# Altium schematic sheet 2020年电赛校赛控制板.SchDoc
size A4
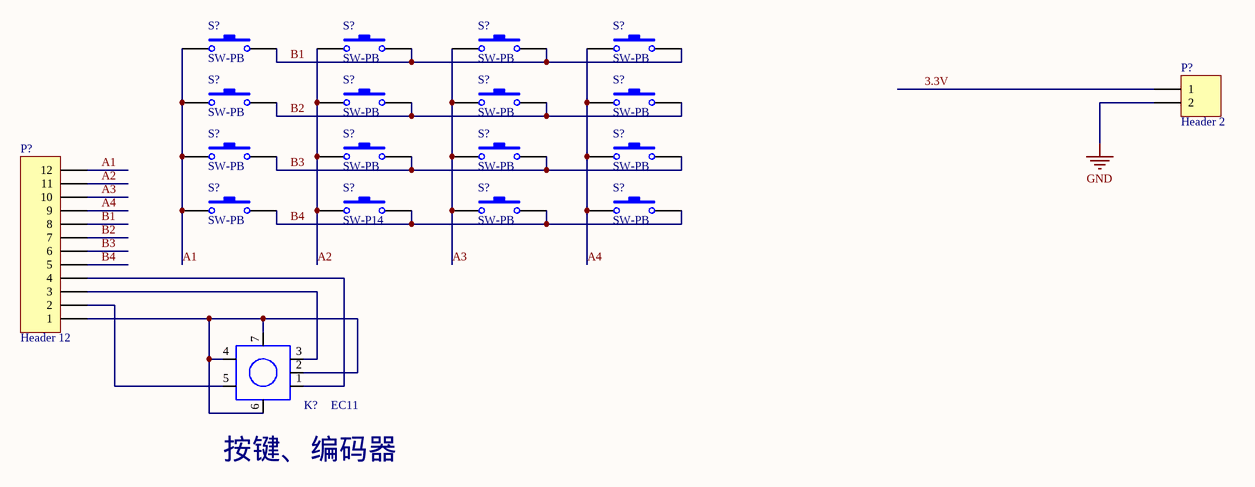
[diagram p0: 2020年电赛校赛控制板.SchDoc]

## Parts
(Parts that share a designator on the sheet are numbered #1, #2 ... from top to bottom, then left to right.)
K?  EC11  [EC11]
P?#1  Header 2  [HDR1X2]
P?#2  Header 12  [HDR1X12]
S?#1  SW-PB  [SPST-2]
S?#2  SW-PB  [SPST-2]
S?#3  SW-PB  [SPST-2]
S?#4  SW-PB  [SPST-2]
S?#5  SW-PB  [SPST-2]
S?#6  SW-PB  [SPST-2]
S?#7  SW-PB  [SPST-2]
S?#8  SW-PB  [SPST-2]
S?#9  SW-PB  [SPST-2]
S?#10  SW-PB  [SPST-2]
S?#11  SW-PB  [SPST-2]
S?#12  SW-PB  [SPST-2]
S?#13  SW-PB  [SPST-2]
S?#14  SW-P14  [SPST-2]
S?#15  SW-PB  [SPST-2]
S?#16  SW-PB  [SPST-2]

## Nets
GND: P?#1.2
3.3V: P?#1.1
A1: P?#2.12 S?#1.1 S?#5.1 S?#9.1 S?#13.1
A2: P?#2.11 S?#2.1 S?#6.1 S?#10.1 S?#14.1
A3: P?#2.10 S?#3.1 S?#7.1 S?#11.1 S?#15.1
A4: P?#2.9 S?#4.1 S?#8.1 S?#12.1 S?#16.1
B1: P?#2.8 S?#1.2 S?#2.2 S?#3.2 S?#4.2
B2: P?#2.7 S?#5.2 S?#6.2 S?#7.2 S?#8.2
B3: P?#2.6 S?#9.2 S?#10.2 S?#11.2 S?#12.2
B4: P?#2.5 S?#13.2 S?#14.2 S?#15.2 S?#16.2
NetK?_1: K?.1(A) P?#2.4
NetK?_2: K?.2(C) K?.4(K1) K?.6 K?.7 P?#2.1
NetK?_3: K?.3(B) P?#2.3
NetK?_5: K?.5(K2) P?#2.2

## Notes on the sheet
- (near K?) 按键、编码器

## Library data of the parts
K? = EC11: 旋转编码器
P?#1 = Header 2: Header, 2-Pin; LatestRevisionDate: 17-Jul-2002; LatestRevisionNote: Re-released for DXP Platform.; Publisher: Altium Limited
P?#2 = Header 12: Header, 12-Pin; LatestRevisionDate: 17-Jul-2002; LatestRevisionNote: Re-released for DXP Platform.; Publisher: Altium Limited
S?#1-S?#16 = SW-PB: Switch; Published: 24-Mar-1999; LatestRevisionDate: 17-Jul-2002; LatestRevisionNote: Re-released for DXP Platform.; PackageReference: SPST-2; Publisher: Altium Limited; PackageDescription: Switch; 2 Leads